# EAGLE design AName (EAGLE 9.0.0)
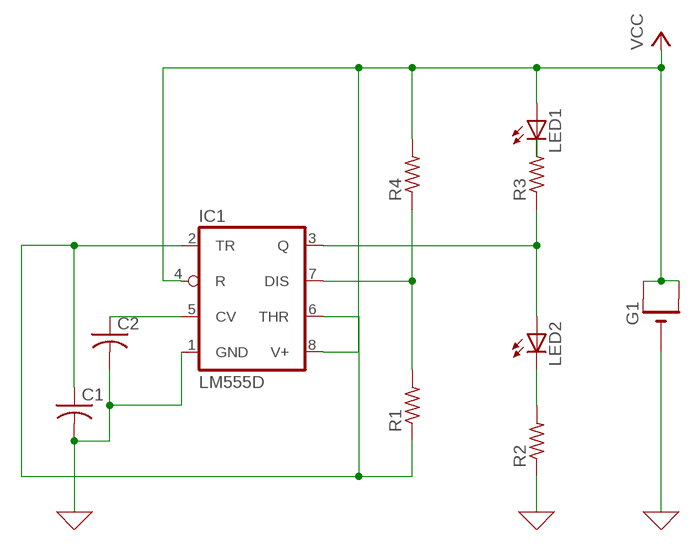
[diagram p0: schematic, sheet 1]

## Parts
C1  C-USC0805  [C0805]
C2  C-USC0805  [C0805]
G1  CR1220THM  [CR1220-THM]
IC1  LM555D  [SO08]
LED1  LED5MM  [LED5MM]
LED2  LED5MM  [LED5MM]
R1  R-US_R0805  [R0805]
R2  R-US_R0805  [R0805]
R3  R-US_M0805  [M0805]
R4  R-US_R0805  [R0805]

## Nets
0: C1.2 C2.2 G1.- IC1.1(GND) R2.1 ; supply symbol labelled GND
N$1: C1.1 IC1.2(TR) IC1.6(THR) R1.1
N$2: C2.1 IC1.5(CV)
N$4: LED2.K(C) R2.2
N$5: IC1.3(Q) LED2.A R3.1
N$6: LED1.K(C) R3.2
N$8: IC1.7(DIS) R1.2 R4.1
VCC: G1.+1(+) G1.+2(+1) IC1.4(R) IC1.8(V+) LED1.A R4.2

## Library data of the parts
C1 C2 = League_555_Blinky:C-US: CAPACITOR, American symbol
G1 = League_555_Blinky:CR1220: CR1216/CR1220/CR1225 12mm 3V lithium coin cell Great for battery packup. Both SMT and THM holders. Note the THM package has the ground pads on both sides of the PCB so that the masks are the same - this reduces the cost
IC1 = League_555_Blinky:*555: TIMER Changed DIP package to have round (not oval) pin pads http://www.ladyada.net/library/pcb/eaglelibrary.html
LED1 LED2 = League_555_Blinky:LED: LED OSRAM: - CHIPLED LG R971, LG N971, LY N971, LG Q971, LY Q971, LO R971, LY R971 LH N974, LH R974 LS Q976, LO Q976, LY Q976 LO Q996 - Hyper CHIPLED LW Q18S LB Q993, LB Q99A, LB R99A - SideLED LS A670, LO A670, LY A670, LG A670, LP A670 LB A673, LV A673, LT A673, LW A673 LH A674 LY A675 LS A676, LA A676, LO A676, LY A676, LW A676 LS A679, LY A679, LG A679 - Hyper Micro SIDELED® LS Y876, LA Y876, LO Y876, LY Y876 LT Y87S - SmartLED LW L88C, LW L88S LB L89C, LB L89S, LG L890 LS L89K, LO L89K, LY L89K LS L896, LA L896, LO L896, LY L896 - TOPLED LS T670, LO T670, LY T670, LG T670, LP T670 LSG T670, LSP T670, LSY T670, LOP T670, LYG T670 LG T671, LOG T671, LSG T671 LB T673, LV T673, LT T673, LW T673 LH T674 LS T676, LA T676, LO T676, LY T676, LB T676, LH T676, LSB T676, LW T676 LB T67C, LV T67C, LT T67C, LS T67K, LO T67K, LY T67K, LW E67C LS E67B, LA E67B, LO E67B, LY E67B, LB E67C, LV E67C, LT E67C LW T67C LS T679, LY T679, LG T679 LS T770, LO T770, LY T770, LG T770, LP T770 LB T773, LV T773, LT T773, LW T773 LH T774 LS E675, LA E675, LY E675, LS T675 LS T776, LA T776, LO T776, LY T776, LB T776 LHGB T686 LT T68C, LB T68C - Hyper Mini TOPLED® LB M676 - Mini TOPLED Santana® LG M470 LS M47K, LO M47K, LY M47K Source: http://www.osram.convergy.de LUXEON: - LUMILED® LXK2-PW12-R00, LXK2-PW12-S00, LXK2-PW14-U00, LXK2-PW14-V00 LXK2-PM12-R00, LXK2-PM12-S00, LXK2-PM14-U00 LXK2-PE12-Q00, LXK2-PE12-R00, LXK2-PE12-S00, LXK2-PE14-T00, LXK2-PE14-U00 LXK2-PB12-K00, LXK2-PB12-L00, LXK2-PB12-M00, LXK2-PB14-N00, LXK2-PB14-P00, LXK2-PB14-Q00 LXK2-PR12-L00, LXK2-PR12-M00, LXK2-PR14-Q00, LXK2-PR14-R00 LXK2-PD12-Q00, LXK2-PD12-R00, LXK2-PD12-S00 LXK2-PH12-R00, LXK2-PH12-S00 LXK2-PL12-P00, LXK2-PL12-Q00, LXK2-PL12-R00 Source: www.luxeon.com KINGBRIGHT: KA-3528ASYC Source: www.kingbright.com
R1 R2 R4 = rcl:R-US_: RESISTOR, American symbol; SPICEPREFIX: R
R3 = League_555_Blinky:R-US_: RESISTOR, American symbol

## Board
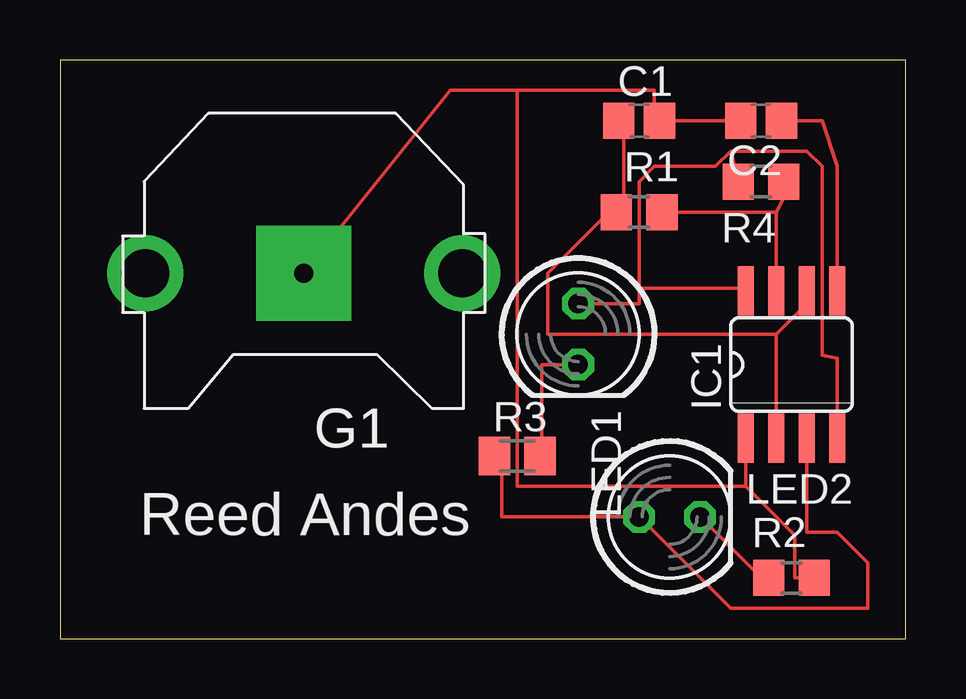
[diagram p1: board, top side]
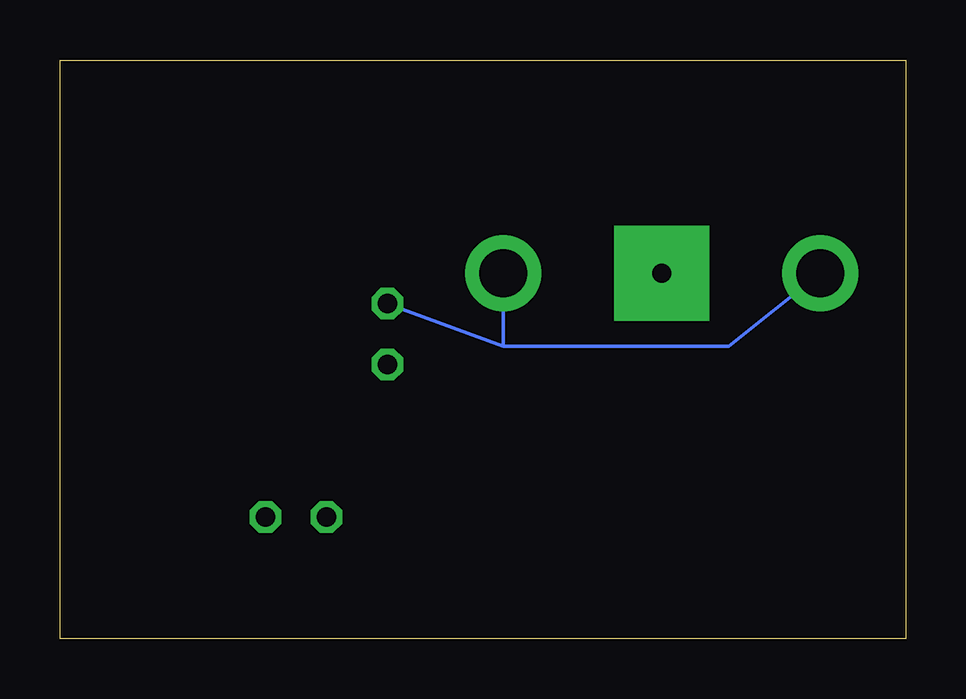
[diagram p2: board, bottom side, seen from below]

Size 35.23 x 24.12 mm. Coordinates in mm from the lower left corner, seen from the top.
Outline: 0,0 35.23,0 35.23,24.12 0,24.12 0,0
Copper layers (1*16): Top 0.035mm / dielectric 1.5mm / Bottom 0.035mm
Design rules "default": minimum track width 6mil, minimum drill 0.35mm, track to track 6mil, track to pad 6mil, pad to pad 6mil, via to via 6mil, smd to smd 6mil, copper to edge 40mil, drill to drill 6mil, minimum pad ring 10mil, minimum via ring 8mil, stop-mask expansion 4mil, vias tented up to drill 0mil, thermal gap 10mil

### Footprints (pad centres in the part's own frame; a part is rotated, then mirrored left to right if it is on the bottom)
C0805 = smd 1.3 x 1.5: 1 -0.85,0; 2 0.85,0
CR1220-THM = drill 2 pad 3.175: +1 -6.604,0; +2 6.604,0 | drill 0.8 pad 3.962 square: - 0,0
SO08 = smd 0.66 x 2.032: 1 -1.905,-3.073; 2 -0.635,-3.073; 3 0.635,-3.073; 4 1.905,-3.073; 5 1.905,3.073; 6 0.635,3.073; 7 -0.635,3.073; 8 -1.905,3.073
LED5MM = drill 0.813 octagon: A -1.27,0; K 1.27,0
R0805 = smd 1.3 x 1.5: 1 -0.95,0; 2 0.95,0
M0805 = smd 1.3 x 1.6: 1 -0.95,0; 2 0.95,0

### Placement (x,y rotation side)
C1  24.13,21.59 0 top
C2  29.21,21.59 180 top
G1  10.16,15.24 180 top
IC1  30.48,11.43 0 top
LED1  21.59,12.7 270 top
LED2  25.4,5.08 0 top
R1  24.13,17.78 0 top
R2  30.48,2.54 180 top
R3  19.05,7.62 0 top
R4  29.21,19.05 180 top

### Tracks (layer width: path | path; a pad name or v marks a point on that pad's centre or on a via)
0
  Top 0.152: 28.57,6.35 30.61,4.32 30.61,2.54 R2.1 | IC1.1 28.57,6.35 | C2.2 C1.2 24.77,21.59 24.77,22.86 19.05,22.86 | 19.05,22.86 16.26,22.86 G1.- | 28.57,6.35 19.05,6.35 19.05,22.86
N$1
  Top 0.152: C1.1 23.5,21.59 23.5,17.78 R1.1 22.86,17.78 20.32,15.24 20.32,12.7 29.84,12.7 | 29.84,12.7 IC1.2 | 29.84,12.7 31.11,13.97 IC1.6
N$2
  Top 0.152: IC1.5 32.38,19.68 31.75,21.59 C2.1
N$4
  Top 0.152: LED2.K 29.21,2.54 R2.2
N$5
  Top 0.152: R3.1 18.41,7.62 18.41,5.08 LED2.A 27.94,1.27 33.65,1.27 33.65,3.18 32.38,4.45 31.11,4.45 IC1.3
N$6
  Top 0.152: LED1.K 20.07,11.43 20.07,7.62 R3.2
N$8
  Top 0.152: 29.84,17.78 R1.2 | 29.84,17.78 30.48,19.05 R4.1 | 29.84,17.78 IC1.7
VCC
  Top 0.152: 27.94,20.32 27.3,19.68 24.77,19.68 24.13,19.05 24.13,14.61 | 24.13,14.61 24.13,13.97 LED1.A | 24.13,14.61 28.57,14.61 IC1.8 | IC1.4 32.38,11.68 31.75,11.81 31.75,19.68 31.11,20.32 27.94,20.32 | 27.94,20.32 R4.2
  Bottom 0.152: G1.+2 7.37,12.19 16.76,12.19 | G1.+1 16.76,12.19 | 16.76,12.19 LED1.A

### Text on the board
tNames: Reed Andes